# EAGLE design 7duino (EAGLE 7.5.0)
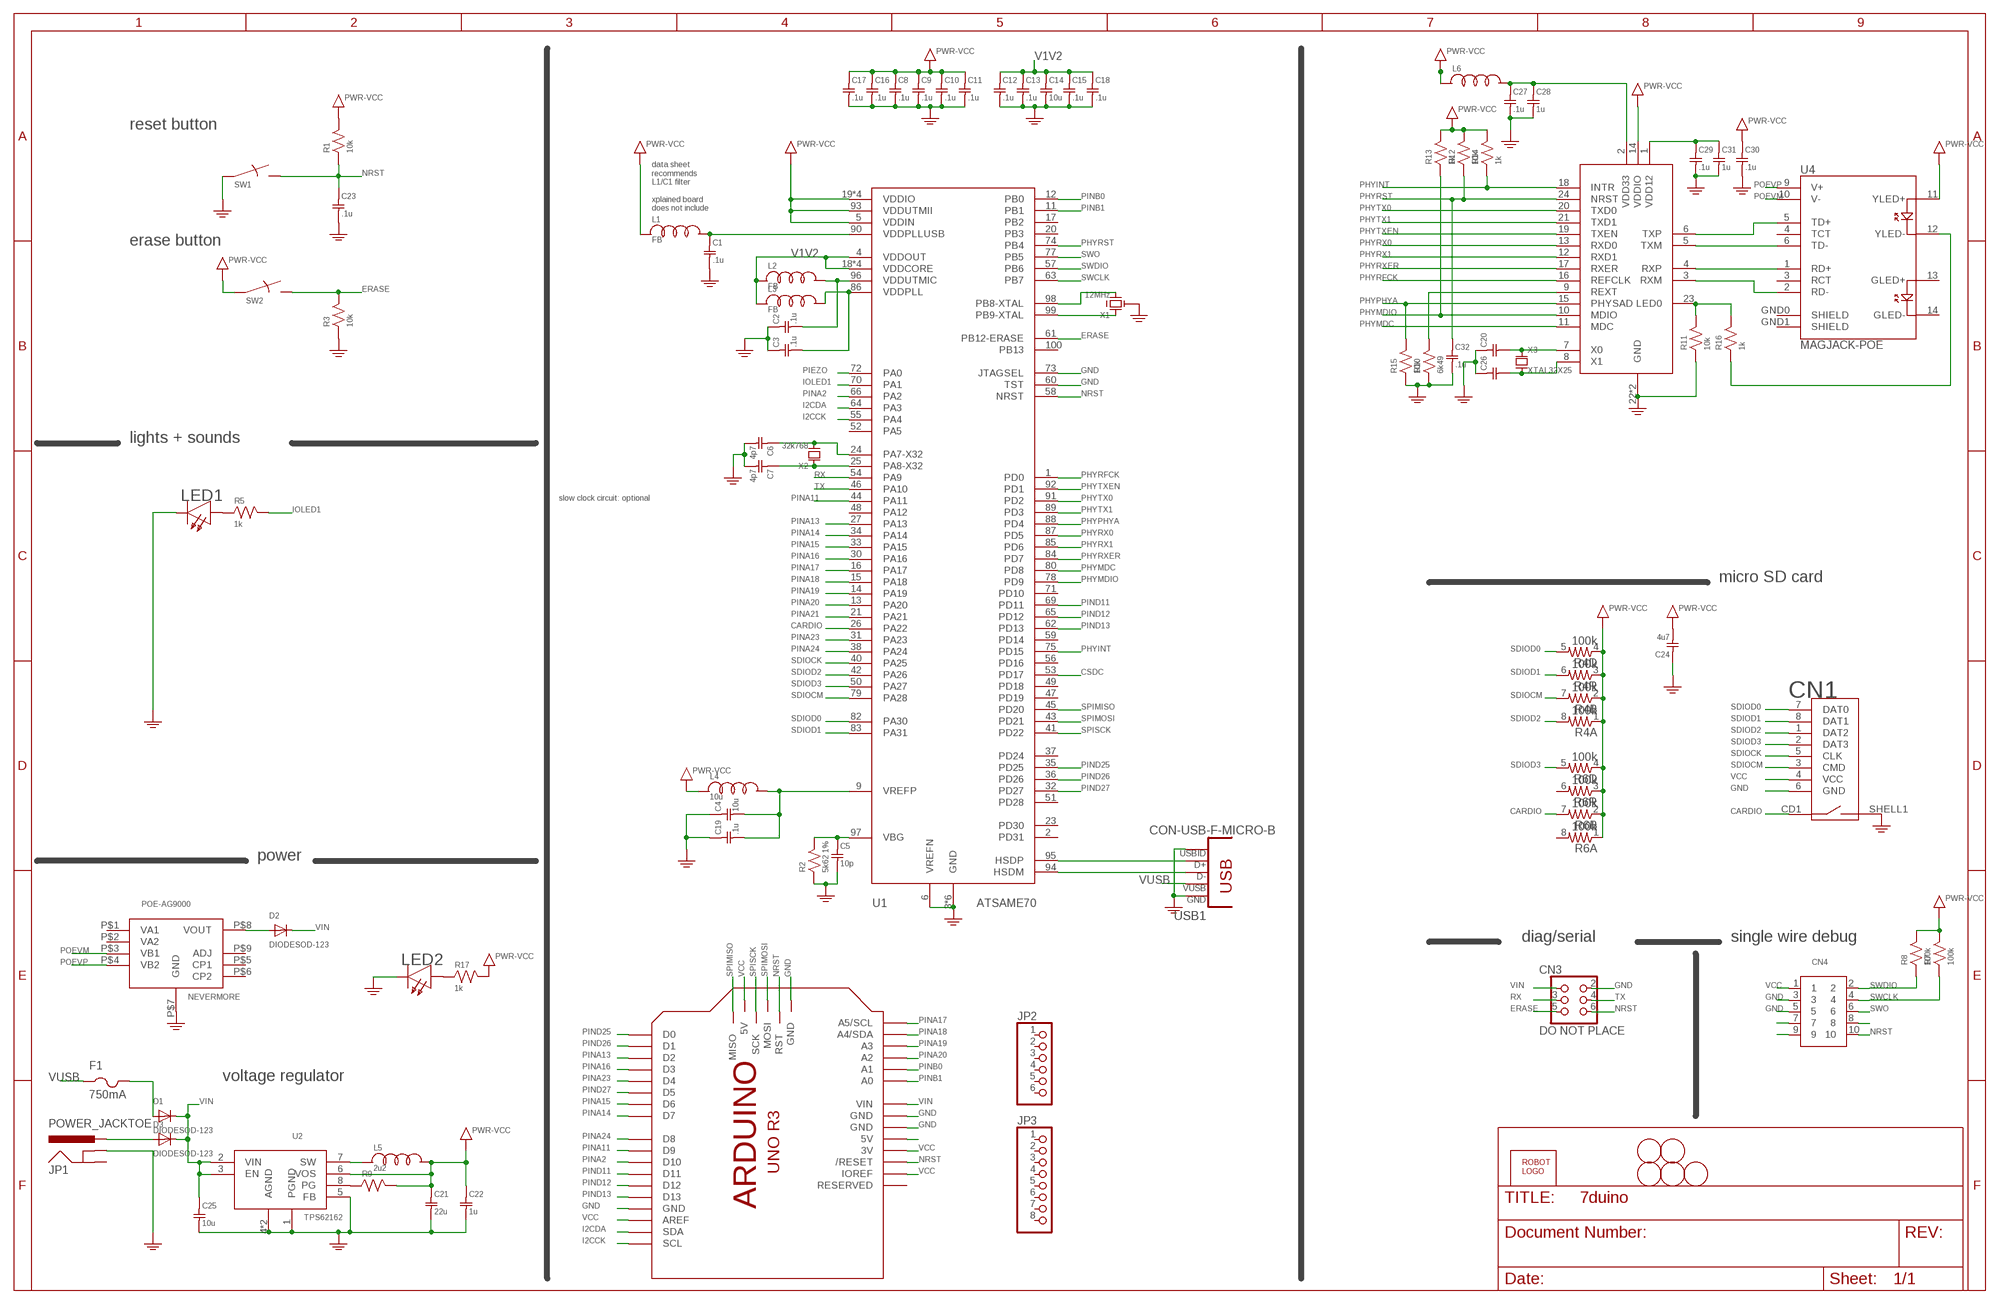
[diagram p0: schematic, sheet 1]

## Parts
C1  .1u  C-0402  [SMD0402]
C2  .1u  C-0402  [SMD0402]
C3  .1u  C-0402  [SMD0402]
C4  10u  C0603  [SMD0603]
C5  10p  C-0402  [SMD0402]
C6  4p7  C-0402  [SMD0402]
C7  4p7  C-0402  [SMD0402]
C8  .1u  C-0402  [SMD0402]
C9  .1u  C-0402  [SMD0402]
C10  .1u  C-0402  [SMD0402]
C11  .1u  C-0402  [SMD0402]
C12  .1u  C-0402  [SMD0402]
C13  .1u  C-0402  [SMD0402]
C14  10u  C0603  [SMD0603]
C15  .1u  C-0402  [SMD0402]
C16  .1u  C-0402  [SMD0402]
C17  .1u  C-0402  [SMD0402]
C18  .1u  C-0402  [SMD0402]
C19  .1u  C-0402  [SMD0402]
C20  C-0402  [SMD0402]
C21  22u  C0805  [SMD0805]
C22  1u  C-0402  [SMD0402]
C23  .1u  C-0402  [SMD0402]
C24  4u7  C0603  [SMD0603]
C25  10u  C0603  [SMD0603]
C26  C-0402  [SMD0402]
C27  .1u  C-0402  [SMD0402]
C28  1u  C-0402  [SMD0402]
C29  .1u  C-0402  [SMD0402]
C30  .1u  C-0402  [SMD0402]
C31  1u  C-0402  [SMD0402]
C32  .1u  C-0402  [SMD0402]
CN1  MICROSD-EJECT  [MICROSD/EJECTOR]
CN3  DO NOT PLACE  HEADER-3X2-POGO  [HEADER-3X2-POGO]
CN4  DO NOT PLACE  HEADER-5X2-SMD-F  [M127-5X2-F]
D1  DIODESOD-123  [SOD-123]
D2  DIODESOD-123  [SOD-123]
D3  DIODESOD-123  [SOD-123]
F1  750mA  FUSE  [SMD1206]
JP1  POWER_JACKTOE  [POWER_JACK_SMD_OVERPASTE_TOE]
JP2  PINHD-1X6CLEAN  [1X06-CLEAN]
JP3  PINHD-1X8CLEANBIG  [1X08-CLEANBIG]
L1  FB  L-0402  [SMD0402]
L2  FB  L-0402  [SMD0402]
L3  FB  L-0402  [SMD0402]
L4  10u  L-0402  [SMD0402]
L5  2u2  L-1210  [SMD1210]
L6  L-0402  [SMD0402]
LED1  white  LED  [SMD0603D]
LED2  white  LED  [SMD0603D]
M1  ARDUINO_R3_ICSP_NODIM  [ARDUINOR3_ICSP_NODIM]
NEVERMORE  POE-AG9000  [POE-AG9000]
R1  10k  R-0402  [SMD0402]
R2  5k62 1%  R-0402  [SMD0402]
R3  10k  R-0402  [SMD0402]
R4  100k  R-ARRAY40603-ARV  [SMD-0603-ARV]
R5  1k  R-0402  [SMD0402]
R6  100k  R-ARRAY40603-ARV  [SMD-0603-ARV]
R7  100k  R-0402  [SMD0402]
R8  100k  R-0402  [SMD0402]
R9  R-0402  [SMD0402]
R10  6k49  R-0402  [SMD0402]
R11  10k  R-0402  [SMD0402]
R12  10k  R-0402  [SMD0402]
R13  1k  R-0402  [SMD0402]
R14  1k  R-0402  [SMD0402]
R15  10k  R-0402  [SMD0402]
R16  1k  R-0402  [SMD0402]
R17  1k  R-0402  [SMD0402]
SW1  SWITCHKMR211  [KMR211]
SW2  SWITCHKMR211  [KMR211]
U1  ATSAME70  [TQFP-100-14X14MM]
U2  TPS62162  TPS62125  [WSON8]
U3  KSZ8081RNA  [LGA24EP]
U4  MAGJACK-POE  [MAGJACK-POE]
U$1  ROBOTMAN-LOGO2  [ROBOTMAN-LOGO2]
U$2  FIDUCIAL  [FIDUCIAL_1MM]
U$3  FIDUCIAL  [FIDUCIAL_1MM]
U$4  FIDUCIAL  [FIDUCIAL_1MM]
U$5  FIDUCIAL  [FIDUCIAL_1MM]
U$6  FIDUCIAL  [FIDUCIAL_1MM]
USB1  CON-USB-F-MICRO-B  [CONN_USB_MICRO-B]
X1  12MHz  RESONATORCTCE  [RESONATOR-CSTCE]
X2  32k768  XTAL32X15  [XTAL-32X15]
X3  XTAL32X25  [XTAL-32X25]

## Nets
CARDIO: CN1.CD1(SW1) R6.7 U1.26(PA22)
CSDC: U1.53(PD17)
ERASE: CN3.5 R3.2 SW2.2 SW2.4 U1.61(PB12-ERASE)
GND: C1.2 C2.1 C3.1 C4.1 C5.2 C6.2 C7.2 C8.2 C9.2 C10.2 C11.2 C12.2 C13.2 C14.2 C15.2 C16.2 C17.2 C18.2 C19.1 C20.1 C21.2 C22.2 C23.2 C24.1 C25.2 C26.1 C27.2 C28.2 C29.2 C30.2 C31.2 C32.2 CN1.6(GND) CN1.SHELL1(SW2) CN3.2 CN4.3 CN4.5 JP1.GND(GNDBREAK) LED1.C LED2.C M1.GND M1.GND@1(GND) M1.GND@2(GND) M1.GND@3(GND) NEVERMORE.P$7(GND) R2.1 R3.1 R10.1 R11.1 R15.1 SW1.1 SW1.3 U1.3(GND) U1.6(VREFN) U1.7(GND) U1.8(GND) U1.10(GND) U1.29(GND) U1.60(TST) U1.67(GND) U1.73(JTAGSEL) U2.1(PGND) U2.4(AGND) U2.5(FB) U2.P$9(AGND) U3.22(GND) U3.P$1(GND) USB1.P4(USBID) USB1.P5(GND) X1.2(G) ; supply symbol labelled PWR-GND
I2CCK: M1.SCL U1.55(PA4)
I2CDA: M1.SDA U1.64(PA3)
IOLED1: R5.2 U1.70(PA1)
N$1: C2.2 L2.2 U1.96(VDDUTMIC)
N$2: C1.1 L1.2 U1.90(VDDPLLUSB)
N$3: C3.2 L3.2 U1.86(VDDPLL)
N$4: LED2.A R17.1
N$5: D2.A NEVERMORE.P$8(VOUT)
N$6: U1.98(PB8-XTAL) X1.3(X2)
N$7: C5.1 R2.2 U1.97(VBG)
N$8: U1.99(PB9-XTAL) X1.1(X1)
N$9: C7.1 U1.25(PA8-X32) X2.P$1
N$10: L5.1 U2.7(SW)
N$11: C6.1 U1.24(PA7-X32) X2.P$2
N$12: U3.6(TXP) U4.5(TD+)
N$15: D3.A JP1.VIN0(PWR)
N$16: LED1.A R5.1
N$17: U3.5(TXM) U4.6(TD-)
N$19: R9.1 U2.8(PG)
N$20: CN4.7
N$21: CN4.9
N$22: U3.4(RXP) U4.1(RD+)
N$23: U3.3(RXM) U4.2(RD-)
N$24: C20.2 U3.7(X0) X3.1
N$25: C26.2 U3.8(X1) X3.3
N$26: CN4.8
N$27: C29.1 C31.1 U3.1(VDD12)
N$28: C27.1 C28.1 L6.2 U3.2(VDD33)
N$29: R10.2 U3.9(REXT)
N$30: R11.2 R16.2 U3.23(LED0)
N$41: D1.A F1.2
N$43: R16.1 U4.12(YLED-)
N$56: M1.5V
NRST: C23.1 CN3.6 CN4.10 M1.RESET(/RESET) M1.RESET_ICSP(RST) R1.1 SW1.2 SW1.4 U1.58(NRST)
PHYINT: R14.1 U1.75(PD15) U3.18(INTR)
PHYMDC: U1.80(PD8) U3.11(MDC)
PHYMDIO: R13.1 U1.78(PD9) U3.10(MDIO)
PHYPHYA: R15.2 U1.88(PD4) U3.15(PHYSAD)
PHYRFCK: U1.1(PD0) U3.16(REFCLK)
PHYRST: C32.1 R12.1 U1.74(PB4) U3.24(NRST)
PHYRX0: U1.87(PD5) U3.13(RXD0)
PHYRX1: U1.85(PD6) U3.12(RXD1)
PHYRXER: U1.84(PD7) U3.17(RXER)
PHYTX0: U1.91(PD2) U3.20(TXD0)
PHYTX1: U1.89(PD3) U3.21(TXD1)
PHYTXEN: U1.92(PD1) U3.19(TXEN)
PIEZO: U1.72(PA0)
PINA2: M1.D10 U1.66(PA2)
PINA11: M1.D9 U1.44(PA11)
PINA13: M1.D2 U1.27(PA13)
PINA14: M1.D7 U1.34(PA14)
PINA15: M1.D6 U1.33(PA15)
PINA16: M1.D3 U1.30(PA16)
PINA17: M1.A5(A5/SCL) U1.16(PA17)
PINA18: M1.A4(A4/SDA) U1.15(PA18)
PINA19: M1.A3 U1.14(PA19)
PINA20: M1.A2 U1.13(PA20)
PINA21: U1.21(PA21)
PINA23: M1.D4 U1.31(PA23)
PINA24: M1.D8 U1.38(PA24)
PINB0: M1.A1 U1.12(PB0)
PINB1: M1.A0 U1.11(PB1)
PIND11: M1.D11 U1.69(PD11)
PIND12: M1.D12 U1.65(PD12)
PIND13: M1.D13 U1.62(PD13)
PIND25: M1.D0 U1.35(PD25)
PIND26: M1.D1 U1.36(PD26)
PIND27: M1.D5 U1.32(PD27)
POEVM: NEVERMORE.P$3(VB1) U4.10(V-)
POEVP: NEVERMORE.P$4(VB2) U4.9(V+)
RX: CN3.3 U1.54(PA9)
SDIOCK: CN1.5(CLK) U1.40(PA25)
SDIOCM: CN1.3(CMD) R4.7 U1.79(PA28)
SDIOD0: CN1.7(DAT0) R4.5 U1.82(PA30)
SDIOD1: CN1.8(DAT1) R4.6 U1.83(PA31)
SDIOD2: CN1.1(DAT2) R4.8 U1.42(PA26)
SDIOD3: CN1.2(DAT3) R6.5 U1.50(PA27)
SPIMISO: M1.MISO U1.45(PD20)
SPIMOSI: M1.MOSI U1.43(PD21)
SPISCK: M1.SCK U1.41(PD22)
SWCLK: CN4.4 R7.1 U1.63(PB7)
SWDIO: CN4.2 R8.1 U1.57(PB6)
SWO: CN4.6 U1.77(PB5)
TX: CN3.4 U1.46(PA10)
USBDM: U1.94(HSDM) USB1.P2(D-)
USBDP: U1.95(HSDP) USB1.P3(D+)
V1V2: C12.1 C13.1 C14.1 C15.1 C18.1 L2.1 L3.1 U1.4(VDDOUT) U1.18(VDDCORE) U1.22(VDDCORE) U1.39(VDDCORE) U1.76(VDDCORE)
VCC: C8.1 C9.1 C10.1 C11.1 C16.1 C17.1 C21.1 C22.1 C24.2 C30.1 CN1.4(VCC) CN4.1 L1.1 L4.1 L5.2 L6.1 M1.3V M1.5V_ICSP(5V) M1.AREF M1.IOREF R1.2 R4.1 R4.2 R4.3 R4.4 R6.1 R6.2 R6.3 R6.4 R7.2 R8.2 R9.2 R12.2 R13.2 R14.2 R17.2 SW2.1 SW2.3 U1.5(VDDIN) U1.19(VDDIO) U1.28(VDDIO) U1.68(VDDIO) U1.81(VDDIO) U1.93(VDDUTMII) U2.6(VOS) U3.14(VDDIO) U4.11(YLED+) ; supply symbol labelled PWR-VCC
VCCA: C4.2 C19.2 L4.2 U1.9(VREFP)
VIN: C25.1 CN3.1 D1.C D2.C D3.C M1.VIN U2.2(VIN) U2.3(EN)
VUSB: F1.1 USB1.P1(VUSB)
Unconnected: JP1.P$4(GND) JP2.1 JP2.2 JP2.3 JP2.4 JP2.5 JP2.6 JP3.1 JP3.2 JP3.3 JP3.4 JP3.5 JP3.6 JP3.7 JP3.8 M1.RESERVED NEVERMORE.P$1(VA1) NEVERMORE.P$2(VA2) NEVERMORE.P$5(CP1) NEVERMORE.P$6(CP2) NEVERMORE.P$9(ADJ) R6.6 R6.8 U1.2(PD31) U1.17(PB2) U1.20(PB3) U1.23(PD30) U1.37(PD24) U1.47(PD19) U1.48(PA12) U1.49(PD18) U1.51(PD28) U1.52(PA5) U1.56(PD16) U1.59(PD14) U1.71(PD10) U1.100(PB13) U4.3(RCT) U4.4(TCT) U4.13(GLED+) U4.14(GLED-) U4.GND0(SHIELD) U4.GND1(SHIELD) USB1.BODY@1(BODY) USB1.BODY@2(BODY) USB1.BODY@3(BODY) USB1.BODY@4(BODY)

## Notes on the sheet
- reset button
- data sheet
  recommends
  L1/C1 filter
  
  xplained board
  does not include
- erase button
- lights + sounds
- slow clock circuit: optional
- micro SD card
- power
- diag/serial | single wire debug
- voltage regulator

## Library data of the parts
C1-C32 = jaw:C
CN1 = jaw:MICROSD
CN3 = jaw:HEADER-3X2
CN4 = jaw:HEADER-5X2
D1-D3 = jaw:DIODE
F1 = jaw:FUSE
JP1 = SparkFun-Connectors:POWER_JACK: Power Jack This is the standard 5.5mm barrel jack for power. The PTH is the most common, proven, reliable, footprint. The Slot footprint only works if the mill layer is transmitted to the PCB fab house so be warned. Mating wall wart : TOL-00298 (and others)
JP2 = adafruit:PINHD-1X6: PIN HEADER
JP3 = adafruit:PINHD-1X8: PIN HEADER
L1-L6 = jaw:L
LED1 LED2 = jaw:LED
M1 = jaw:ARDUINO_R3_ICSP
NEVERMORE = jaw:POE-AG9000
R1-R3 R5 R7-R17 = jaw:R
R4 R6 = jaw:R-ARRAY4: Array Chip Resistor Source: RS Component / Phycomp
SW1 SW2 = jaw:SWITCH
U1 = jaw:ATSAME70
U2 = jaw:TPS62125
U3 = jaw:KSZ8081RNA
U4 = SparkFun-Connectors:MAGJACK-POE: PoE compatible MagJack
U$1 = jaw:ROBOTMAN-LOGO
U$2-U$6 = adafruit:FIDUCIAL: For use by pick and place machines to calibrate the vision/machine, 1mm By microbuilder.eu
USB1 = dp_devices:CON-USB-F: USB Female connector
X1 = jaw:RESONATOR
X2 X3 = jaw:XTAL

## Board
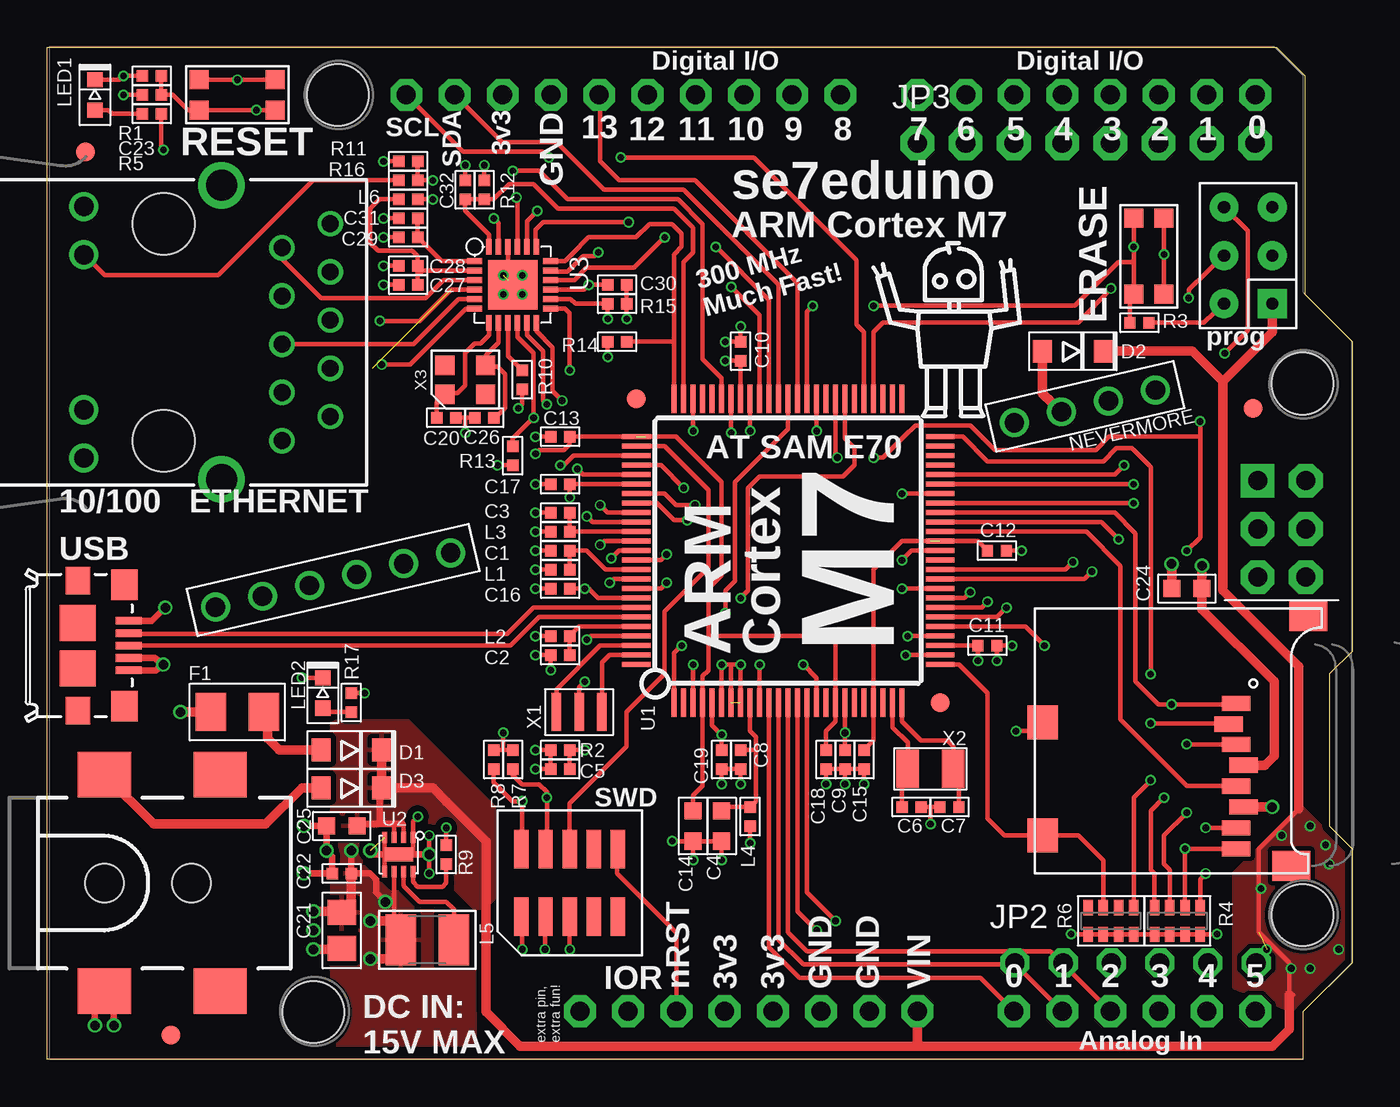
[diagram p1: board, top side]
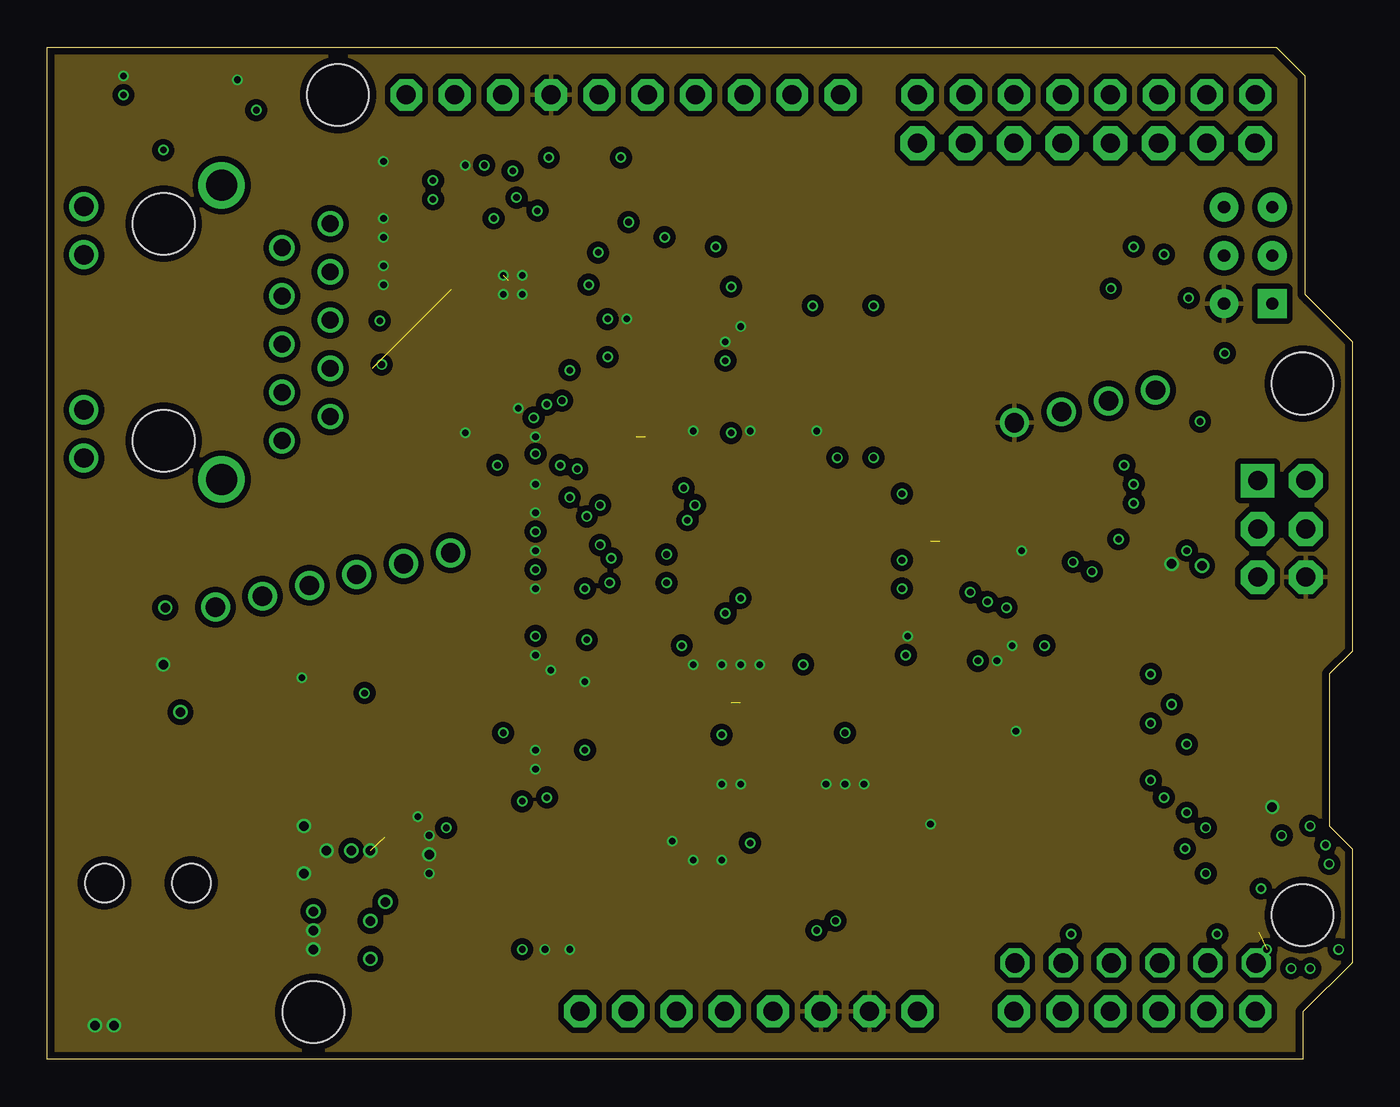
[diagram p2: board, inner layer Route2]
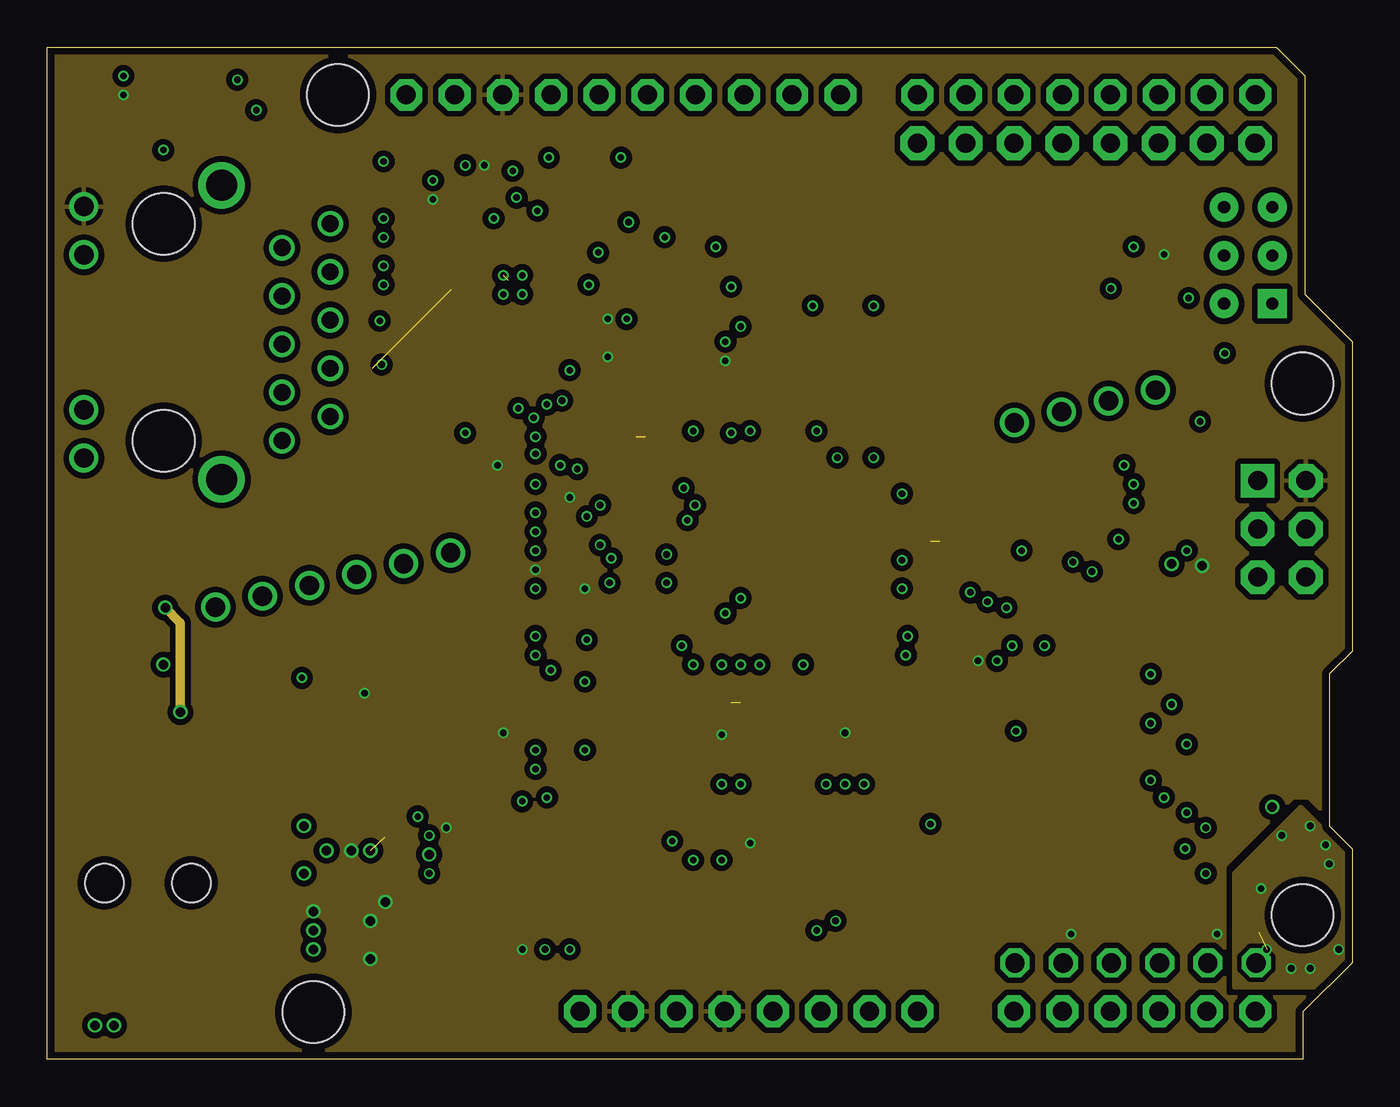
[diagram p3: board, inner layer Route15]
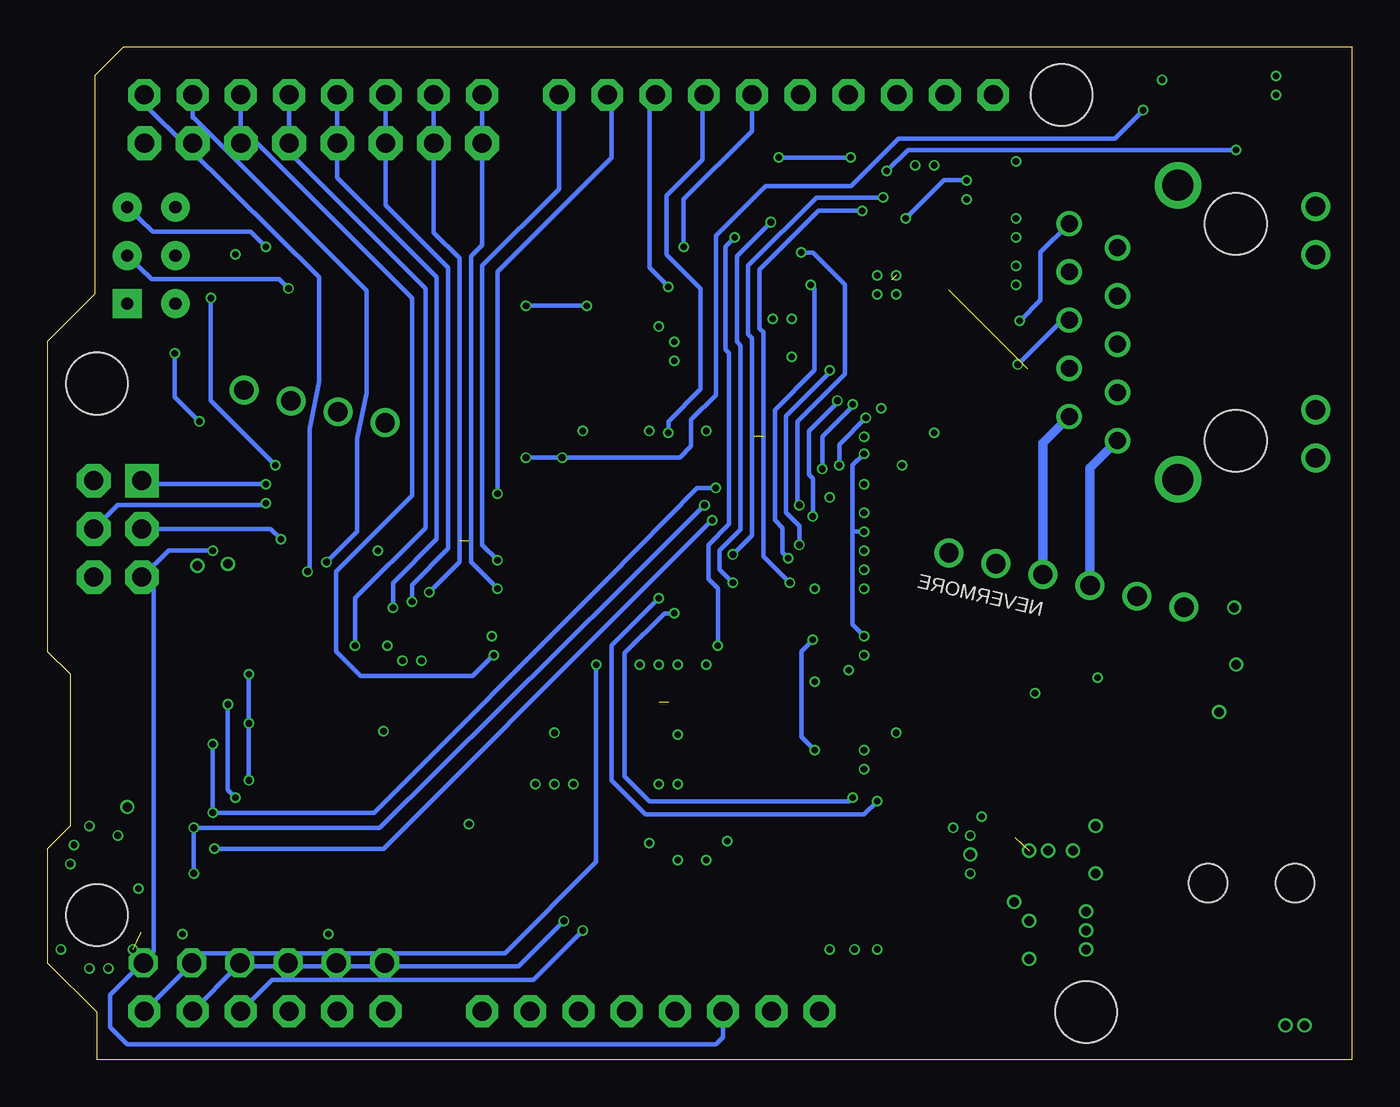
[diagram p4: board, bottom side, seen from below]

Size 68.7 x 53.3 mm. Coordinates in mm from the lower left corner, seen from the top.
Outline: 0,53.3 64.7,53.3 66.2,51.8 66.2,40.3 68.7,37.8 68.7,21.5 67.5,20.3 67.5,12.3 68.7,11.1 68.7,5.1 66.1,2.5 66.1,0 0,0 0,53.3
Copper layers (1*2*15*16): Top 0.035559375mm / dielectric 0.17018125mm / Route2 0.01778125mm / dielectric 47mil / Route15 0.01778125mm / dielectric 0.17018125mm / Bottom 0.035559375mm
Design rules "OSHPark-4layer *": minimum track width 5mil, minimum drill 10mil, track to track 5mil, track to pad 5mil, pad to pad 5mil, via to via 5mil, smd to smd 5mil, copper to edge 15mil, drill to drill 6mil, minimum pad ring 4mil, minimum via ring 4mil, stop-mask expansion 4mil, vias tented up to drill 0.55mm, thermal gap 10mil
Holes 3.25 mm at 66.1,7.6 66.1,35.6 14,2.5 15.3,50.8

### Footprints (pad centres in the part's own frame; a part is rotated, then mirrored left to right if it is on the bottom)
SMD0402 = smd 0.6 x 0.6: 1 -0.5,0; 2 0.5,0
SMD0603 = smd 0.9 x 0.9: 1 -0.8,0; 2 0.8,0
SMD0805 = smd 1.3 x 1.5: 1 -0.95,0; 2 0.95,0
MICROSD/EJECTOR = smd 0.8 x 1.5: 1 1.96,-3.1; 2 0.86,-2.7; 3 -0.2,-3.1; 4 -1.3,-3.5; 5 -2.4,-3.1; 6 -3.5,-3.5; 7 -4.6,-3.1; 8 -5.7,-3.1 | smd 1.8 x 1.6: CD1 -5,7.1; SHELL1 0.96,7.1 | smd 1.6 x 2: SHELL2 -6.6,-6; SHELL3 6.56,-6.9
HEADER-3X2-POGO = drill 0.635 pad 1.524 square: 1 0,0 | drill 0.635 pad 1.524: 2 0,2.54; 3 2.54,0; 4 2.54,2.54; 5 5.08,0; 6 5.08,2.54
M127-5X2-F = smd 0.762 x 2.032: 1 -2.54,-1.778; 2 -2.54,1.778; 3 -1.27,-1.778; 4 -1.27,1.778; 5 0,-1.778; 6 0,1.778; 7 1.27,-1.778; 8 1.27,1.778; 9 2.54,-1.778; 10 2.54,1.778
SOD-123 = smd 1 x 1.2: A 1.6,0; C -1.6,0
SMD1206 = smd 1.6 x 2: 1 -1.4,0; 2 1.4,0
POWER_JACK_SMD_OVERPASTE_TOE = smd 2.8 x 2.4: GND 0,-5.7; P$4 6.1,-5.7; VIN0 0,5.7; VIN1 6.1,5.7 | hole 2.032: 0,0; 4.572,0
1X06-CLEAN = drill 1.016 octagon: 1 -6.35,0; 2 -3.81,0; 3 -1.27,0; 4 1.27,0; 5 3.81,0; 6 6.35,0
1X08-CLEANBIG = drill 1.016 pad 1.778 octagon: 1 -8.89,0; 2 -6.35,0; 3 -3.81,0; 4 -1.27,0; 5 1.27,0; 6 3.81,0; 7 6.35,0; 8 8.89,0
SMD1210 = smd 1.6 x 2.7: 1 -1.4,0; 2 1.4,0
SMD0603D = smd 0.8 x 0.8: A 0.8,0; C -0.8,0
ARDUINOR3_ICSP_NODIM = drill 1 pad 1.676 octagon: 3V 35.56,2.54; 5V 38.1,2.54; A0 50.8,2.54; A1 53.34,2.54; A2 55.88,2.54; A3 58.42,2.54; A4 60.96,2.54; A5 63.5,2.54; AREF 23.876,50.8; D0 63.5,50.8; D1 60.96,50.8; D2 58.42,50.8; D3 55.88,50.8; D4 53.34,50.8; D5 50.8,50.8; D6 48.26,50.8; D7 45.72,50.8; D8 41.656,50.8; D9 39.116,50.8; D10 36.576,50.8; D11 34.036,50.8; D12 31.496,50.8; D13 28.956,50.8; GND 26.416,50.8; GND@1 43.18,2.54; GND@2 40.64,2.54; IOREF 30.48,2.54; RESERVED 27.94,2.54; RESET 33.02,2.54; SCL 18.796,50.8; SDA 21.336,50.8; VIN 45.72,2.54 | drill 1 pad 1.778 octagon: 5V_ICSP 66.167,30.48; GND@3 66.167,25.4; MOSI 66.167,27.94; RESET_ICSP 63.627,25.4; SCK 63.627,27.94 | drill 1 pad 1.778 square: MISO 63.627,30.48
POE-AG9000 = drill 1.016: P$1 0,0; P$2 2.54,0; P$3 5.08,0; P$4 7.62,0; P$5 10.16,0; P$6 12.7,0; P$7 43.18,0; P$8 45.72,0; P$9 48.26,0; P$10 50.8,0
SMD-0603-ARV = smd 0.5 x 0.8: 1 -1.2,-0.7; 2 -0.4,-0.7; 3 0.4,-0.7; 4 1.2,-0.7; 5 1.2,0.7; 6 0.4,0.7; 7 -0.4,0.7; 8 -1.2,0.7
KMR211 = smd 1 x 1: 1 -2,0.8; 2 -2,-0.8; 3 2,0.8; 4 2,-0.8
TQFP-100-14X14MM = smd 1.5 x 0.27: 1 -8,6; 2 -8,5.5; 3 -8,5; 4 -8,4.5; 5 -8,4; 6 -8,3.5; 7 -8,3; 8 -8,2.5; 9 -8,2; 10 -8,1.5; 11 -8,1; 12 -8,0.5; 13 -8,0; 14 -8,-0.5; 15 -8,-1; 16 -8,-1.5; 17 -8,-2; 18 -8,-2.5; 19 -8,-3; 20 -8,-3.5; 21 -8,-4; 22 -8,-4.5; 23 -8,-5; 24 -8,-5.5; 25 -8,-6; 51 8,-6; 52 8,-5.5; 53 8,-5; 54 8,-4.5; 55 8,-4; 56 8,-3.5; 57 8,-3; 58 8,-2.5; 59 8,-2; 60 8,-1.5; 61 8,-1; 62 8,-0.5; 63 8,0; 64 8,0.5; 65 8,1; 66 8,1.5; 67 8,2; 68 8,2.5; 69 8,3; 70 8,3.5; 71 8,4; 72 8,4.5; 73 8,5; 74 8,5.5; 75 8,6 | smd 0.27 x 1.5: 26 -6,-8; 27 -5.5,-8; 28 -5,-8; 29 -4.5,-8; 30 -4,-8; 31 -3.5,-8; 32 -3,-8; 33 -2.5,-8; 34 -2,-8; 35 -1.5,-8; 36 -1,-8; 37 -0.5,-8; 38 0,-8; 39 0.5,-8; 40 1,-8; 41 1.5,-8; 42 2,-8; 43 2.5,-8; 44 3,-8; 45 3.5,-8; 46 4,-8; 47 4.5,-8; 48 5,-8; 49 5.5,-8; 50 6,-8; 76 6,8; 77 5.5,8; 78 5,8; 79 4.5,8; 80 4,8; 81 3.5,8; 82 3,8; 83 2.5,8; 84 2,8; 85 1.5,8; 86 1,8; 87 0.5,8; 88 0,8; 89 -0.5,8; 90 -1,8; 91 -1.5,8; 92 -2,8; 93 -2.5,8; 94 -3,8; 95 -3.5,8; 96 -4,8; 97 -4.5,8; 98 -5,8; 99 -5.5,8; 100 -6,8
WSON8 = smd 0.6 x 0.25: 1 -0.9,0.75; 2 -0.9,0.25; 3 -0.9,-0.25; 4 -0.9,-0.75; 5 0.9,-0.75; 6 0.9,-0.25; 7 0.9,0.25; 8 0.9,0.75 | smd 0.75 x 1.5: P$9 0,0
LGA24EP = smd 0.3 x 0.8: 1 -1.25,-2; 2 -0.75,-2; 3 -0.25,-2; 4 0.25,-2; 5 0.75,-2; 6 1.25,-2; 13 1.25,2; 14 0.75,2; 15 0.25,2; 16 -0.25,2; 17 -0.75,2; 18 -1.25,2 | smd 0.8 x 0.3: 7 2,-1.25; 8 2,-0.75; 9 2,-0.25; 10 2,0.25; 11 2,0.75; 12 2,1.25; 19 -2,1.25; 20 -2,0.75; 21 -2,0.25; 22 -2,-0.25; 23 -2,-0.75; 24 -2,-1.25 | smd 2.6 x 2.6: P$1 0,0
MAGJACK-POE = drill 0.89: 1 5.72,-8.89; 2 4.45,-6.35; 3 3.18,-8.89; 4 1.91,-6.35; 5 0.64,-8.89; 6 -0.63,-6.35; 7 -1.9,-8.89; 8 -3.17,-6.35; 9 -4.44,-8.89; 10 -5.71,-6.35 | drill 1.02: 11 6.625,4.08; 12 4.085,4.08; 13 -4.085,4.08; 14 -6.625,4.08 | drill 1.63: GND0 -7.745,-3.17; GND1 7.745,-3.17 | hole 3.25: -5.715,-0.12; 5.715,-0.12
FIDUCIAL_1MM = smd 1 x 1: 1 0,0
CONN_USB_MICRO-B = smd 1.6 x 1.4: BODY@1 -3.2,2.45; BODY@2 3.2,2.45 | smd 1.45 x 1.3: BODY@3 3.425,0; BODY@6 -3.425,0 | smd 1.9 x 1.9: BODY@4 1.2,0; BODY@5 -1.2,0 | smd 0.4 x 1.35: P1 -1.3,2.675; P2 -0.65,2.675; P3 0,2.675; P4 0.65,2.675; P5 1.3,2.675
RESONATOR-CSTCE = smd 0.5 x 2: 1 -1.2,0; 2 0,0; 3 1.2,0
XTAL-32X15 = smd 1.2 x 2: P$1 -1.2,0; P$2 1.2,0
XTAL-32X25 = smd 1.016 x 1.016: 1 -1.067,-0.762; 3 1.067,0.762; P$2 -1.067,0.762; P$4 1.067,-0.762

### Placement (x,y rotation side)
C1  27,26.8 180 top
C2  27,21.3 0 top
C3  27,28.8 0 top
C4  35.5,12.3 90 top
C5  27,15.3 180 top
C6  45.5,13.3 0 top
C7  47.5,13.3 180 top
C8  35.5,15.8 270 top
C9  42,15.8 270 top
C10  36.5,37.3 90 top
C11  49.5,21.8 0 top
C12  50,26.8 0 top
C13  27,32.8 180 top
C14  34,12.3 270 top
C15  43,15.8 270 top
C16  27,24.8 180 top
C17  27,30.3 180 top
C18  41,15.8 270 top
C19  36.5,15.8 90 top
C20  21,33.8 180 top
C21  15.5,6.8 270 top
C22  15.5,9.8 180 top
C23  5.5,51.8 180 top
C24  60,24.8 0 top
C25  15.5,12.3 180 top
C26  23,33.8 0 top
C27  19,40.8 180 top
C28  19,41.8 180 top
C29  19,43.3 180 top
C30  30,39.8 0 top
C31  19,44.3 180 top
C32  22,45.8 90 top
CN1  59.5,16.8 90 top
CN3  64.5,39.8 90 top
CN4  27.5,9.3 0 top
D1  16,16.3 180 top
D2  54,37.3 180 top
D3  16,14.3 180 top
F1  10,18.3 0 top
JP1  3,9.3 0 top
JP2  57.3,5.08 0 top
JP3  54.7,48.26 0 top
L1  27,25.8 0 top
L2  27,22.3 0 top
L3  27,27.8 0 top
L4  37,12.8 90 top
L5  20,6.3 180 top
L6  19,45.3 180 top
LED1  2.5,50.8 270 top
LED2  14.5,19.3 270 top
M1  0.1,0 0 top
NEVERMORE  8.85,23.83 13 top
R1  5.5,50.8 180 top
R2  27,16.3 0 top
R3  57.5,38.8 180 top
R4  59.5,7.3 0 top
R5  5.5,49.8 0 top
R6  56,7.3 0 top
R7  24.5,15.8 90 top
R8  23.5,15.8 90 top
R9  21,10.8 90 top
R10  25,35.8 90 top
R11  19,47.3 0 top
R12  23,45.8 90 top
R13  24.5,31.8 270 top
R14  30,37.8 180 top
R15  30,40.8 180 top
R16  19,46.3 0 top
R17  16,18.8 90 top
SW1  10,50.8 0 top
SW2  58,42.3 270 top
U1  39,26.8 90 top
U2  18.5,10.8 270 top
U3  24.5,40.8 270 top
U4  6,38.3 90 top
U$1  47.7,38.3 0 top
U$2  6.5,1.3 0 top
U$3  63.5,34.3 0 top
U$4  2,47.8 0 top
U$5  31,34.8 90 top
U$6  47,18.8 90 top
USB1  1.6,21.8 270 top
X1  28,18.3 180 top
X2  46.5,15.3 180 top
X3  22,35.8 0 top

### Tracks (layer width: path | path; a pad name or v marks a point on that pad's centre or on a via)
CARDIO
  Top 0.25: R6.7 55.6,10.5 54.3,11.8 CN1.CD1 50.4,11.8 49.5,12.7 49.5,19.3 48,20.8 U1.26
ERASE  (via drill 0.35)
  Top 0.25: U1.61 40,39.4 v40.3,39.7 | SW2.2 v57.2,42.8 57.2,42.1 | 57.2,42.1 SW2.4 57,40.1 R3.2 | v43.5,39.7 54.1,39.7 56.4,42 57.1,42 57.2,42.1
  Bottom 0.25: CN3.5 63.16,43.6 58,43.6 v57.2,42.8 | v40.3,39.7 v43.5,39.7
GND  (via drill 0.35, 0.5)  (3 unrouted)
  Top 0.25: v25.7,21.3 C2.1 v26.5,20.5 | C16.2 v25.7,24.8 | C1.2 v25.7,26.8 | C3.1 v25.7,28.8 | C17.2 v25.7,30.3 | C13.2 v25.7,32.8 | X1.2 28,19.6 v28.3,19.9 | v35.7,37.8 C10.2 v36.5,38.6 | U1.67 v37,33.1 | v50,21 C11.2 v50.8,21.8 | v51.3,26.8 C12.2 | U1.29 v45.3,22.3 | U1.3 v34,20.8 | U1.6 v35.5,20.8 v36.5,20.8 U1.8 | U1.10 v37.5,20.8 | U1.7 36,20.8 | v41,14.5 C18.2 C9.2 | C9.2 v42,14.5 | v43,14.5 C15.2 C9.2 | U1.60 v40.5,33.1 | U1.73 v34,33.1 | v35.5,14.5 C8.2 C19.1 v36.5,14.5 | C14.2 C4.1 v35.5,10.5 | C6.2 46.5,13.3 | 46.5,13.3 C7.2 | v46.5,12.4 46.5,13.3 | v25.7,16.3 R2.1 C5.2 v25.7,15.3 | U2.4 U2.5 | 19.2,10.8 19.25,10.85 U2.1 19.25,12.55 v19.5,12.8 | C27.2 v17.7,40.8 | C28.2 v17.7,41.8 | C29.2 v17.7,43.3 | C31.2 v17.7,44.3 | C20.1 22,33.8 | 22,33.8 C26.1 | v22,33 22,33.8 | R10.1 25,34.5 v24.8,34.3 | v30.5,39 C30.2 R15.1 | R11.1 v17.7,47.3 | U3.22 24.25,41.05 U3.P$1 | C32.2 v22,47.1 | v20.1,11.8 v20.1,10.8 v20.1,9.8 | SW1.3 v10,51.6 SW1.1 | LED1.C 3.8,51.6 v4,51.8 C23.2 | v34,10.5 C14.2 | C14.2 v32.9,11.5 | R3.1 60.9,38.8 CN3.2 | v27.5,5.8 CN4.5 | v26.2,5.8 26.2,7.49 CN4.3 | v51,17.3 52.36,17.3 CN1.SHELL1 | LED2.C v13.4,20.1
  Top 0.35: v20.1,10.8 19.2,10.8 U2.P$9 17.2,10.8 v17,11 | v13.5,12.3 C25.2 v14.7,11 15,10.7 C22.2 v13.5,9.8 | JP1.GND 2.5,3.1 v2.5,1.8 | v3.5,1.8 3.5,3.1 JP1.GND | 3.8,2.8 JP1.GND | 3.2,3.8 JP1.GND | USB1.P4 5.65,21.15 v6.1,20.8 5.7,20.5 USB1.P5
  Top 0.5: C24.1 v59.2,26.1 | CN1.6 v64.5,13.3 | v14,5.8 15.25,5.8 C21.2
  other vias: 14,6.8 24,41.3 25,41.3 25,40.3 24,40.3
  pour Route2 (isolate 0.3, rank 2): 0,53.3 64.7,53.3 66.2,51.8 66.2,40.4 68.8,37.8 68.8,5.1 66.2,2.5 66.2,-0.2 0,-0.2
I2CCK  (via drill 0.35)
  Top 0.25: M1.SCL 21.9,47.8 26.1,47.8 v26.4,47.5 | U1.55 43,38.3 42.6,38.7 42.6,42.1 37.2,47.5 v30.2,47.5
  Bottom 0.25: v26.4,47.5 v30.2,47.5
I2CDA
  Top 0.25: M1.SDA 23.94,48.3 26.8,48.3 29.3,45.8 33.5,45.8 38.5,40.8 U1.64
IOLED1  (via drill 0.35)
  Top 0.25: U1.70 35.5,35.9 34.5,36.9 34.5,44 33.2,45.3 27.4,45.3 25.9,46.8 v24.5,46.8 | v6.1,47.9 6,48 R5.2
  Bottom 0.25: v24.5,46.8 23.4,47.9 v6.1,47.9
N$1
  Top 0.25: U1.96 28,22.8 L2.2 27.5,21.8 C2.2
N$2
  Top 0.25: U1.90 29.4,25.8 28.4,26.8 C1.1 L1.2
N$3
  Top 0.25: U1.86 L3.2 C3.2
N$4
  Top 0.25: R17.1 14.8,18.3 LED2.A
N$5
  Top 0.5: NEVERMORE.P$8 52.4,35.08 D2.A
N$6
  Top 0.25: U1.98 29.1,21.8 26.8,19.5 X1.3
N$7  (via drill 0.35)
  Top 0.25: U1.97 28.6,22.3 v28.4,22.1 | C5.1 R2.2 v28.3,16.3
  Bottom 0.25: v28.4,22.1 29,21.5 29,17 v28.3,16.3
N$8
  Top 0.25: U1.99 29.6,21.3 29.2,20.9 X1.1
N$9
  Top 0.25: U1.25 45,17.8 46,16.8 47.4,16.8 47.7,16.5 X2.P$1 48,15 C7.1
N$10
  Top 0.25: U2.7 18.75,9.15 19.6,8.3 21,8.3 21.4,7.9 L5.1
N$11
  Top 0.25: U1.24 44.5,17.5 45.3,16.7 X2.P$2 45,15 C6.1
N$12  (via drill 0.35)
  Top 0.25: U3.6 22.05,39.55 19.1,36.6 v17.6,36.6
  Bottom 0.25: v17.6,36.6 15.26,38.94 U4.5
N$15
  Top 0.5: JP1.VIN0 5.6,12.4 11.5,12.4 13.4,14.3 D3.A
N$16
  Top 0.25: R5.1 3.4,49.8 3.2,50 LED1.A
N$17
  Top 0.25: U3.5 21.65,40.05 19.27,37.67 U4.6
N$18
  cutout Top: 35.2,17.9 37.3,17.9 37.3,20.3 35.2,20.3
N$19
  Top 0.25: U2.8 19.25,9.35 19.5,9.1 20.8,9.1 21,9.3 R9.1
N$22  (via drill 0.35)  (1 unrouted)
  Top 0.25: U3.4 21.25,40.55 19.6,38.9 v17.5,38.9
  Bottom 0.25: v17.5,38.9 16.4,40 16.4,42.3 16.4,42.51 U4.1
N$23
  Top 0.25: U3.3 20.85,41.05 19.9,40.1 14.4,40.1 12.4,42.1 12.4,42.7 U4.2
N$24
  Top 0.25: U3.7 23.25,38.15 22.8,37.7 22.5,37.7 22,37.2 22,35.5 21.6,35.1 21,35.1 X3.1 20.5,34.61 C20.2
N$25
  Top 0.25: U3.8 23.75,37.75 23.1,37.1 23.1,36.59 X3.3 23.13,36.5 23.7,36.5 24.1,36.1 24.1,34.3 23.6,33.8 C26.2
N$27
  Top 0.25: C31.1 C29.1 20.75,42.05 U3.1
N$28
  Top 0.25: C27.1 19.5,41.3 | 19.5,41.3 C28.1 19.5,42.3 19.2,42.6 17.4,42.6 17,43 17,44.8 17.5,45.3 L6.2 | U3.2 19.75,41.55 19.5,41.3
N$29
  Top 0.25: U3.9 24.25,37.05 R10.2
N$30  (via drill 0.35)
  Top 0.25: R11.2 R16.2 v20.3,46.3 | U3.23 23.75,44.05 v23.5,44.3
  Bottom 0.25: v23.5,44.3 21.5,46.3 v20.3,46.3
N$41
  Top 0.5: 11.6,18.3 11.5,18.3 | 11.5,18.3 11.6,18.3 | 11.6,18.3 11.5,18.3 | 11.5,18.3 F1.2 | 11.6,18.3 11.6,16.9 12.2,16.3 D1.A
N$43
  Top 0.25: R16.1 14,46.3 9,41.3 3.01,41.3 U4.12
NRST  (via drill 0.35)
  Top 0.25: SW1.4 v11,50 SW1.2 7.4,50 6.6,50.8 R1.1 C23.1 | CN3.6 63.2,43.64 63.2,38.7 | v41.6,31.7 41.5,31.8 41.5,32.8 U1.58 | 63.2,38.7 63.2,38.5 | 60.7,32.8 60.7,33.4 v60.7,33.6 | 60.7,32.8 60.7,27.5 v60,26.8 | M1.RESET 33.12,6.68 30,9.8 30,11.04 CN4.10 | v43.5,31.7 44,31.7 45.1,32.8 45.7,33.4 48.6,33.4 49.9,32.1 55.2,32.1 55.9,32.8 60.7,32.8 | v62,37.2 63.2,38.4 63.2,38.7
  Bottom 0.25: v11,50 12.5,48.5 23.9,48.5 26.4,46 30.9,46 33.5,43.4 33.5,35 34.8,33.7 34.8,32.3 35.4,31.7 v41.6,31.7 v43.5,31.7 | v60,26.8 62.33,26.8 M1.RESET_ICSP 63.1,24.77 63.1,5.7 65.4,3.4 65.4,1.7 64.5,0.8 33.5,0.8 33.12,1.18 M1.RESET | v60.7,33.6 62,34.9 v62,37.2
PHYINT
  Top 0.25: U3.18 27.25,42.05 27.6,42.4 28.5,43.3 31,43.3 31.7,44 32.9,44 33.4,43.5 33.4,42.8 33,42.4 33,37.8 | U1.75 33,37.8 | R14.1 33,37.8
PHYMDC  (via drill 0.35)
  Top 0.25: U3.11 25.25,38.15 26.1,37.3 26.1,34.7 v26.3,34.5 | U1.80 28.2,30.8 v27.9,31.1
  Bottom 0.25: v27.9,31.1 27.9,32.8 26.3,34.4 v26.3,34.5
PHYMDIO  (via drill 0.35)
  Top 0.25: U3.10 24.75,38.05 25.6,37.2 v25.6,33.8 24.5,32.7 R13.1 | U1.78 27.7,31.8 27.5,31.6 27.2,31.3 v27,31.3
  Bottom 0.25: v25.6,33.8 27,32.4 v27,31.3
PHYPHYA  (via drill 0.35)
  Top 0.25: U1.88 30.1,26.8 v29.7,26.4 | U3.15 28.25,40.55 v28.5,40.8 R15.2
  Bottom 0.25: v29.7,26.4 30,26.7 30,28 30.4,28.4 30.4,34.2 28.3,36.3 28.3,40.6 v28.5,40.8
PHYRFCK  (via drill 0.35)
  Top 0.25: U1.1 33,21.4 v33.4,21.8 | U3.16 27.75,41.05 28.4,41.7 30.9,41.7 v32.5,43.3
  Bottom 0.25: v33.4,21.8 33.4,24.8 33.9,25.3 33.9,27.1 32.8,28.2 32.8,37.2 33,37.4 33,42.8 v32.5,43.3
PHYRST
  Top 0.25: U3.24 23.25,43.45 22,44.7 C32.1 R12.1 23.5,45.3 24.3,46.1 25.6,46.1 26.9,44.8 33,44.8 34,43.8 34,42.5 33.5,42 U1.74
PHYRX0  (via drill 0.35)
  Top 0.25: U3.13 27.25,39.55 27.5,39.3 v27.5,36.3 | v29.1,27.1 29.3,27.3 U1.87
  Bottom 0.25: v27.5,36.3 27.5,36.2 29.8,33.9 29.8,28.8 29.1,28.1 v29.1,27.1
PHYRX1  (via drill 0.35)
  Top 0.25: U3.12 25.75,38.35 26.6,37.5 26.6,35.2 v27.1,34.7 | U1.85 28.7,28.3 v28.4,28.6
  Bottom 0.25: v28.4,28.6 28.4,30.6 28.6,30.8 28.6,33.1 27.1,34.6 v27.1,34.7
PHYRXER  (via drill 0.35)
  Top 0.25: U3.17 26.55,41.55 26.6,41.5 27.4,41.5 28.2,42.3 28.8,42.3 v29,42.5 | U1.84 29.5,28.8 v29.1,29.2
  Bottom 0.25: v29.1,29.2 29.2,29.3 29.2,33.6 26.7,36.1 26.7,40.8 28.4,42.5 v29,42.5
PHYTX0  (via drill 0.35)
  Top 0.25: U1.91 29.8,25.3 v29.6,25.1 | v25.8,44.7 25.25,44.15 U3.20
  Bottom 0.25: v25.8,44.7 28.1,44.7 31.2,41.6 31.2,38.5 31,38.3 31,26.5 v29.6,25.1
PHYTX1  (via drill 0.35)
  Top 0.25: U1.89 32.3,26.3 v32.6,26.6 | v24.7,45.4 24.75,45.35 U3.21
  Bottom 0.25: v24.7,45.4 28.2,45.4 31.8,41.8 31.8,38.2 31.6,38 31.6,27.6 v32.6,26.6
PHYTXEN  (via drill 0.35)
  Top 0.25: U1.92 32.3,24.8 v32.6,25.1 | v30.6,44.1 26.1,44.1 25.7,43.7 25.7,42.85 U3.19
  Bottom 0.25: v32.6,25.1 33.3,25.8 33.3,26.8 32.2,27.9 32.2,37.6 32.4,37.8 32.4,42.3 v30.6,44.1
PINA2  (via drill 0.35)
  Top 0.25: U1.66 37.5,39.2 v36,40.7
  Bottom 0.25: v36,40.7 37,41.7 37,48.5 37,50.48 M1.D10
PINA11  (via drill 0.35)
  Top 0.25: U1.44 v45,29.8
  Bottom 0.25: v45,29.8 45,41.5 39,47.5 39,50.58 M1.D9
PINA13  (via drill 0.35)
  Top 0.25: v45.2,21.3 U1.27
  Bottom 0.25: M1.D2 58.52,49.12 49.5,40.1 49.5,29.7 53.5,25.7 53.5,21.5 52.2,20.2 46.3,20.2 v45.2,21.3
PINA14  (via drill 0.35)
  Top 0.25: U1.34 v45,24.8
  Bottom 0.25: v45,24.8 46.4,26.2 46.4,42.3 45.82,42.88 M1.D7
PINA15  (via drill 0.35)
  Top 0.25: v48.6,24.6 48.3,24.3 U1.33
  Bottom 0.25: M1.D6 48.36,43.56 47,42.2 47,26.2 v48.6,24.6
PINA16  (via drill 0.35)
  Top 0.25: v52.5,21.8 51.5,22.8 U1.30
  Bottom 0.25: M1.D3 55.98,47.78 48.8,40.6 48.8,28 52.5,24.3 v52.5,21.8
PINA17  (via drill 0.35)
  Top 0.25: U1.16 40.5,20.1 v39.8,20.8
  Bottom 0.25: v39.8,20.8 39.8,10.4 44.6,5.6 60.54,5.6 M1.A5
PINA18  (via drill 0.35)
  Top 0.25: U1.15 40,8.8 v41.5,7.3
  Bottom 0.25: v41.5,7.3 43.9,4.9 58.7,4.9 M1.A4
PINA19  (via drill 0.35)
  Top 0.25: U1.14 39.5,7.8 v40.5,6.8
  Bottom 0.25: v40.5,6.8 43.1,4.2 56.5,4.2 56.86,4.2 M1.A3
PINA20
  Top 0.25: U1.13 39,6.7 40,5.7 52.82,5.7 M1.A2
PINA23  (via drill 0.35)
  Top 0.25: v50.5,23.8 50,23.3 U1.31
  Bottom 0.25: M1.D4 53.44,46.44 48.2,41.2 48.2,27.4 50.5,25.1 v50.5,23.8
PINA24  (via drill 0.35)
  Top 0.25: U1.38 45.5,26.8 v45,26.3
  Bottom 0.25: v45,26.3 45.8,27.1 45.8,41.8 41.76,45.84 M1.D8
PINB0
  Top 0.25: U1.12 38.5,6.3 39.8,5 50.98,5 M1.A1
PINB1
  Top 0.25: U1.11 38,5.9 39.6,4.3 49.14,4.3 M1.A0
PIND11  (via drill 0.35)
  Top 0.25: U1.69 v36,33
  Bottom 0.25: v36,33 36,33.6 34.3,35.3 34.3,40.6 36.1,42.4 36.1,45.5 34.2,47.4 34.2,50.74 M1.D11
PIND12  (via drill 0.35)
  Top 0.25: U1.65 38,40 v35.2,42.8
  Bottom 0.25: v35.2,42.8 35.2,45.3 31.6,48.9 M1.D12
PIND13
  Top 0.25: U1.62 39.5,40.36 39.5,40.9 34.1,46.3 30.1,46.3 29.1,47.3 29.1,50.76 M1.D13
PIND25  (via drill 0.35)
  Top 0.25: v55,25.7 54.6,25.3 U1.35
  Bottom 0.25: 63.5,50.8 M1.D0 63.6,50.3 54.4,41.2 54.4,35.7 54.9,33.2 54.9,25.7 v55,25.7
PIND26  (via drill 0.35)
  Top 0.25: v54,26.2 53.6,25.8 U1.36
  Bottom 0.25: M1.D1 61.06,49.6 61,49.6 51.9,40.5 51.9,35.1 52.4,32.7 52.4,27.8 v54,26.2
PIND27  (via drill 0.35)
  Top 0.25: U1.32 49.2,23.8 v49.5,24.1
  Bottom 0.25: M1.D5 50.9,45 47.6,41.7 47.6,26.9 49.5,25 v49.5,24.1
POEVM
  Bottom 0.5: U4.10 13.8,31.14 NEVERMORE.P$3
POEVP
  Bottom 0.5: U4.9 16.28,32.47 NEVERMORE.P$4
RX  (via drill 0.35)
  Top 0.25: U1.54 43.5,38.3 44,38.8 54.3,38.8 v56,40.6
  Bottom 0.25: CN3.3 63.2,41.1 56.8,41.1 56.5,41.1 v56,40.6
SDIOCK
  Top 0.25: U1.40 54.7,27.8 56.5,26 56.5,17.9 60,14.4 62.5,14.4 CN1.5
SDIOCM  (via drill 0.35)
  Top 0.25: U1.79 32.3,31.3 v33.5,30.1 | v60,16.6 62.5,16.6 CN1.3 | R4.7 59.1,10 58.8,10.3 58.8,11.8 v60,13
  Bottom 0.25: v33.5,30.1 34.5,30.1 39.2,25.3 51.5,13 v60,13 v60,16.6 60,16.1
SDIOD0  (via drill 0.35)
  Top 0.25: U1.82 32.5,29.8 33.1,29.2 v34.1,29.2 | CN1.7 v61,12.2 | R4.5 60.7,9.5 v61,9.8
  Bottom 0.25: v34.1,29.2 38.5,24.8 51.2,12.2 v61,12.2 v61,9.8
SDIOD1  (via drill 0.35)
  Top 0.25: U1.83 32.1,29.3 33,28.4 v33.7,28.4 | CN1.8 v59.9,11.1 59.9,10.6 R4.6
  Bottom 0.25: v33.7,28.4 37.8,24.3 51,11.1 v59.9,11.1
SDIOD2  (via drill 0.35)
  Top 0.25: U1.42 56.2,28.8 57.3,27.7 57.3,19.9 58.5,18.7 v59.2,18.7 62.54,18.7 CN1.1 | R4.8 58.3,9.8 58.1,10 58.1,13.1 v58.8,13.8
  Bottom 0.25: v58.8,13.8 59.2,14.2 v59.2,18.7
SDIOD3  (via drill 0.35)
  Top 0.25: v58.1,20.3 58.1,31.2 57.1,32.2 56.3,32.2 55.6,31.5 49.5,31.5 48.2,32.8 U1.50 | v58.1,17.7 62.16,17.7 CN1.2 | R6.5 57.2,13.8 v58.1,14.7
  Bottom 0.25: v58.1,20.3 58.1,18.2 v58.1,17.7 v58.1,14.7
SPIMISO  (via drill 0.35)
  Top 0.25: U1.45 v57.2,30.3
  Bottom 0.25: v57.2,30.3 63.55,30.3 M1.MISO
SPIMOSI  (via drill 0.35)
  Top 0.25: U1.43 54.1,29.3 v57.2,29.3
  Bottom 0.25: M1.MOSI 65.01,29.2 62.8,29.2 57.3,29.2 v57.2,29.3
SPISCK  (via drill 0.35)
  Top 0.25: U1.41 55.5,28.3 v56.4,27.4
  Bottom 0.25: v56.4,27.4 56.94,27.94 M1.SCK
SWCLK  (via drill 0.35)
  Top 0.25: U1.63 39,33.2 36.2,30.4 36.2,25.2 35.7,24.7 v35.7,23.5 | CN4.4 26.3,11.15 v26.3,13.8 26.3,14.1 25.9,14.5 25,14.5 24.5,15 R7.1
  Bottom 0.25: v35.7,23.5 36.2,23.5 38.3,21.4 38.3,14.9 37,13.6 26.5,13.6 v26.3,13.8
SWDIO  (via drill 0.35)
  Top 0.25: U1.57 42,32.7 42.5,32.2 42.5,31.3 41.9,30.7 37.5,30.7 36.9,30.1 36.9,24.7 v36.5,24.3 | CN4.2 25,11.12 v25,13.6 24.5,13.6 23.5,14.6 R8.1
  Bottom 0.25: v36.5,24.3 39,21.8 39,14.7 37.2,12.9 25.7,12.9 v25,13.6
SWO
  Top 0.25: U1.77 32.5,32.3 34,30.8 34.8,30 34.8,27.3 34.8,25.9 32.5,23.6 32.5,20.3 30.5,18.3 30.5,16.5 27.5,13.5 CN4.6
TX  (via drill 0.35)
  Top 0.25: U1.46 56.2,30.8 v56.7,31.3 | v60.1,40.1 60.1,40.54 CN3.4
  Bottom 0.25: v56.7,31.3 60.1,34.7 v60.1,40.1
USBDM
  Top 0.25: U1.94 25.6,23.8 24.2,22.4 4.33,22.4 USB1.P2
USBDP
  Top 0.25: U1.95 25.9,23.3 24.4,21.8 USB1.P3
V1V2  (via drill 0.35)  (2 unrouted)
  Top 0.25: U1.39 49,27.3 C12.1 | C15.1 43.5,16.8 U1.22 43.5,22.3 | C18.1 41,17.3 41.5,17.8 U1.18 41.5,22.3 | 34.8,22.3 34.8,20.5 34.5,20.2 U1.4 34.5,14.4 34,13.9 C14.1 | 46.5,27.3 45,27.3 43.5,25.8 43.5,22.3 | 31.5,32.8 33,32.8 33.1,32.8 35.5,30.4 35.5,25.5 34.8,24.8 34.8,22.3 | L2.1 v25.7,22.3 | 41.5,22.3 34.8,22.3 | 41.5,22.3 43.5,22.3 | U1.76 C13.1 27.5,32.4 27.2,32.1 25.9,32.1 v25.7,31.9 | L3.1 v25.7,27.8 L3.1
  Bottom 0.25: v25.7,31.9 26.3,31.3 26.3,27.8 | 26.3,27.8 26.3,22.9 v25.7,22.3 | v25.7,27.8 26.3,27.8
VCC  (via drill 0.35, 0.5)
  Top 0.25: U1.93 29,24.3 28.5,24.8 v28.3,24.8 C16.1 | U1.81 C17.1 v27.5,29.6 | U1.68 C10.1 v35.7,36.8 | U1.28 C11.1 v49,21 | U1.19 v42,17.2 C9.1 | U1.5 35,17.6 v35.5,17.1 C8.1 | L1.1 v25.7,25.8 | R9.2 v21,12.2 | U2.6 18.25,8.3 | 18.25,8.3 18.25,7.2 18.25,5.3 18.35,6.55 L5.2 | v17.8,8.3 18.25,8.3 | L6.1 v20.3,45.3 | U3.14 27.55,40.05 27.8,39.8 C30.1 v29.5,39 | R13.2 v23.7,31.3 | R12.2 v23,47.1 | v29.5,37 R14.2 | v53.9,6.6 R6.1 R6.2 R6.3 R6.4 R4.1 R4.2 R4.3 R4.4 v61.6,6.6 | R1.2 v4,50.8 | L4.1 v37,11.4 | SW2.1 v58.8,42.4 SW2.3 | v25,5.8 25,7.48 CN4.1 | R7.2 24,16.3 | 24,16.3 R8.2 | v24,17.2 24,16.3 | R17.2 v16.7,19.3
  Top 0.35: v16,11 16,10.7 C22.1 17,9.8 17.3,9.5 17.3,8.8 v17.8,8.3
  Top 0.5: v17,5.3 18.25,5.3 | CN1.4 64.1,15.5 64.6,16 64.6,19.9 60.8,23.7 C24.2 v60.8,26 | C22.1 16,8.25 C21.1 15.45,7.8 v14,7.8 | v17,7.3 18.15,7.3 18.25,7.2
  pour Top (isolate 0.25, rank 2): 15,11.3 15,0.8 22.5,0.8 22.5,8.8 18,8.8 16.5,10.3 16.5,11.3
  pour Route15 (isolate 0.3, rank 2): 0,53.3 64.7,53.3 66.2,51.8 66.2,40.4 68.8,37.8 68.8,5.1 66.2,2.5 66.2,-0.2 0,-0.2
VCCA
  Top 0.25: U1.9 37,17.3 37.3,17 37.3,16.3 | 37.3,16.3 37.3,13.6 L4.2 35.5,13.3 C4.2 | C19.2 37.3,16.3
VIN  (via drill 0.35)  (1 unrouted)
  Top 0.25: U2.2 18.75,12.3 18.7,12.4 | U2.3 18.25,12.4 18.4,12.4 | 65.4,3.4 65.4,5.1 63.8,6.7 63.8,11.1 65.9,13.2 | 65.6,3.4 65.5,3.4
  Top 0.35: C25.1 16.3,12.4 17.5,12.4 | 18.7,12.4 18.4,12.4 18.25,12.4 17.5,12.4 | 17.5,14.3 17.5,12.4
  Top 0.5: 45.8,0.7 45.4,0.7 24.9,0.7 23.1,2.5 23.1,11.5 21,13.6 20.3,14.3 D3.C D1.C | 45.8,0.7 64.5,0.7 65.4,1.6 65.4,3.4 | 65.9,13.2 65.9,20.7 61.9,24.7 61.9,35.7 | 61.9,35.7 64.5,38.3 CN3.1 | M1.VIN 45.82,0.72 45.8,0.7 | D2.C 60.3,37.3 61.9,35.7
  other vias: 66.5,12.3 67.3,11.3 65,11.8 63.9,9 64.2,5.8 65.5,4.8 66.5,4.8 67.5,10.3 68,5.8
  pour Top (isolate 0.3): 15,12.3 15,17.8 19,17.8 23.5,13.3 23.5,8.5 23,8 22.5,8 21.5,9 21.5,12.3
  pour Top (isolate 0.25): 66,13.3 62.5,9.8 62.5,3.8 65.5,2.6 68.6,5.7 68.6,10.7
  pour Route15 (isolate 0.25): 66,13.3 62.5,9.8 62.5,3.8 66.7,3.8 68.6,5.7 68.6,10.7
VUSB  (via drill 0.5)
  Top 0.35: USB1.P1 5.5,23.1 v6.2,23.8
  Top 0.5: v7,18.3 F1.1
  Route15 0.5: v6.2,23.8 7,23 v7,18.3

### Text on the board
tPlace: Digital I/O | Digital I/O | SDA | 3v3 | GND | SCL | 13 | 12 | 11 | 10 | 9 | 8 | 7 | 6 | 5 | 4 | 3 | 2 | 1 | 0 | RESET | se7eduino | ARM Cortex M7 | 300 MHz / Much Fast! | ERASE | prog | AT SAM E70 | 10/100 ETHERNET | USB | ARM | Cortex | M7 | SWD | 0 | 1 | 2 | 3 | 4 | 5 | IOR | nRST | 3v3 | 3v3 | GND | GND | VIN | extra pin, / extra fun! | DC IN: / 15V MAX | Analog In